# EAGLE design matrix mixer 7eurorack (EAGLE 8.2.2)
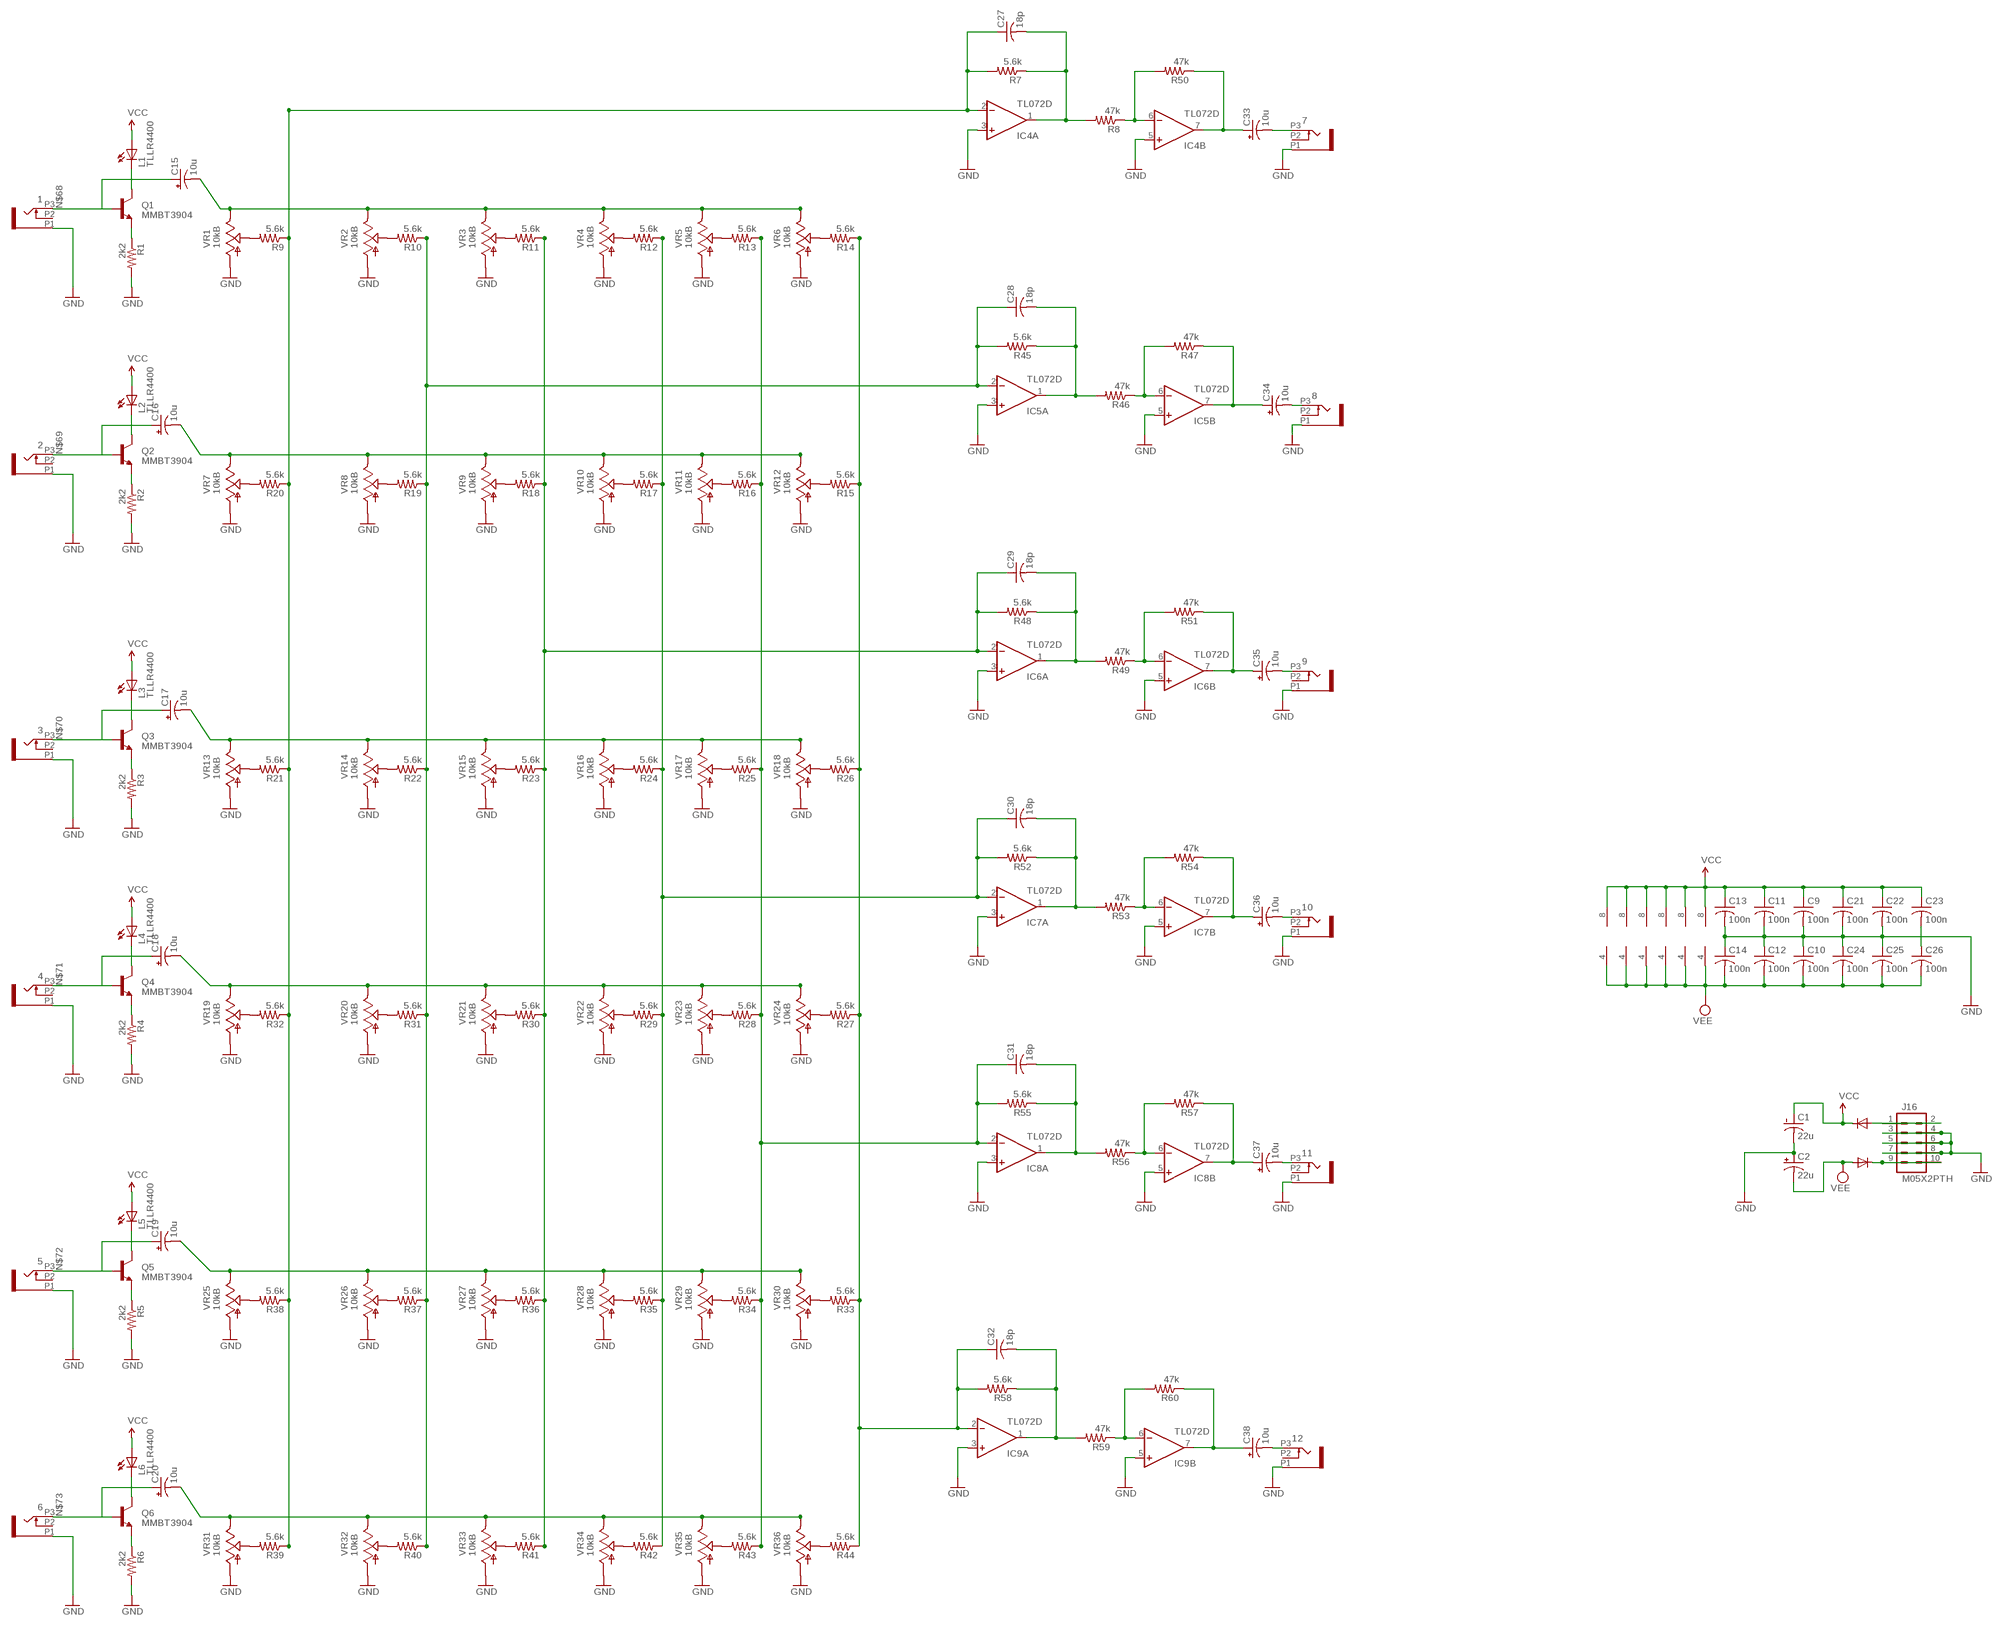
[diagram p0: schematic, sheet 1]

## Parts
1  PJ301_THONKICONN6  [WQP_PJ_301M6]
2  PJ301_THONKICONN6  [WQP_PJ_301M6]
3  PJ301_THONKICONN6  [WQP_PJ_301M6]
4  PJ301_THONKICONN6  [WQP_PJ_301M6]
5  PJ301_THONKICONN6  [WQP_PJ_301M6]
6  PJ301_THONKICONN6  [WQP_PJ_301M6]
7  PJ301_THONKICONN6  [WQP_PJ_301M6]
8  PJ301_THONKICONN6  [WQP_PJ_301M6]
9  PJ301_THONKICONN6  [WQP_PJ_301M6]
10  PJ301_THONKICONN6  [WQP_PJ_301M6]
11  PJ301_THONKICONN6  [WQP_PJ_301M6]
12  PJ301_THONKICONN6  [WQP_PJ_301M6]
C1  22u  CPOL-USB  [PANASONIC_B]
C2  22u  CPOL-USB  [PANASONIC_B]
C9  100n  C-USC0603  [C0603]
C10  100n  C-USC0603  [C0603]
C11  100n  C-USC0603  [C0603]
C12  100n  C-USC0603  [C0603]
C13  100n  C-USC0603  [C0603]
C14  100n  C-USC0603  [C0603]
C15  10u  CPOL-USB  [PANASONIC_B]
C16  10u  CPOL-USB  [PANASONIC_B]
C17  10u  CPOL-USB  [PANASONIC_B]
C18  10u  CPOL-USB  [PANASONIC_B]
C19  10u  CPOL-USB  [PANASONIC_B]
C20  10u  CPOL-USB  [PANASONIC_B]
C21  100n  C-USC0603  [C0603]
C22  100n  C-USC0603  [C0603]
C23  100n  C-USC0603  [C0603]
C24  100n  C-USC0603  [C0603]
C25  100n  C-USC0603  [C0603]
C26  100n  C-USC0603  [C0603]
C27  18p  C-USC0603  [C0603]
C28  18p  C-USC0603  [C0603]
C29  18p  C-USC0603  [C0603]
C30  18p  C-USC0603  [C0603]
C31  18p  C-USC0603  [C0603]
C32  18p  C-USC0603  [C0603]
C33  10u  CPOL-USB  [PANASONIC_B]
C34  10u  CPOL-USB  [PANASONIC_B]
C35  10u  CPOL-USB  [PANASONIC_B]
C36  10u  CPOL-USB  [PANASONIC_B]
C37  10u  CPOL-USB  [PANASONIC_B]
C38  10u  CPOL-USB  [PANASONIC_B]
D1  1N5819HW  DIODE-SOD123  [SOD123]
D2  1N5819HW  DIODE-SOD123  [SOD123]
IC4  TL072D  [SO08]
IC5  TL072D  [SO08]
IC6  TL072D  [SO08]
IC7  TL072D  [SO08]
IC8  TL072D  [SO08]
IC9  TL072D  [SO08]
J16  M05X2PTH  [AVR_ICSP]
L1  TLLR4400  [LED3MM]
L2  TLLR4400  [LED3MM]
L3  TLLR4400  [LED3MM]
L4  TLLR4400  [LED3MM]
L5  TLLR4400  [LED3MM]
L6  TLLR4400  [LED3MM]
Q1  MMBT3904  MMBT3904LT1-NPN-SOT23-BEC  [SOT23-BEC]
Q2  MMBT3904  MMBT3904LT1-NPN-SOT23-BEC  [SOT23-BEC]
Q3  MMBT3904  MMBT3904LT1-NPN-SOT23-BEC  [SOT23-BEC]
Q4  MMBT3904  MMBT3904LT1-NPN-SOT23-BEC  [SOT23-BEC]
Q5  MMBT3904  MMBT3904LT1-NPN-SOT23-BEC  [SOT23-BEC]
Q6  MMBT3904  MMBT3904LT1-NPN-SOT23-BEC  [SOT23-BEC]
R1  2k2  R-US_R0603  [R0603]
R2  2k2  R-US_R0603  [R0603]
R3  2k2  R-US_R0603  [R0603]
R4  2k2  R-US_R0603  [R0603]
R5  2k2  R-US_R0603  [R0603]
R6  2k2  R-US_R0603  [R0603]
R7  5.6k  R-US_R0603  [R0603]
R8  47k  R-US_R0603  [R0603]
R9  5.6k  R-US_R0603  [R0603]
R10  5.6k  R-US_R0603  [R0603]
R11  5.6k  R-US_R0603  [R0603]
R12  5.6k  R-US_R0603  [R0603]
R13  5.6k  R-US_R0603  [R0603]
R14  5.6k  R-US_R0603  [R0603]
R15  5.6k  R-US_R0603  [R0603]
R16  5.6k  R-US_R0603  [R0603]
R17  5.6k  R-US_R0603  [R0603]
R18  5.6k  R-US_R0603  [R0603]
R19  5.6k  R-US_R0603  [R0603]
R20  5.6k  R-US_R0603  [R0603]
R21  5.6k  R-US_R0603  [R0603]
R22  5.6k  R-US_R0603  [R0603]
R23  5.6k  R-US_R0603  [R0603]
R24  5.6k  R-US_R0603  [R0603]
R25  5.6k  R-US_R0603  [R0603]
R26  5.6k  R-US_R0603  [R0603]
R27  5.6k  R-US_R0603  [R0603]
R28  5.6k  R-US_R0603  [R0603]
R29  5.6k  R-US_R0603  [R0603]
R30  5.6k  R-US_R0603  [R0603]
R31  5.6k  R-US_R0603  [R0603]
R32  5.6k  R-US_R0603  [R0603]
R33  5.6k  R-US_R0603  [R0603]
R34  5.6k  R-US_R0603  [R0603]
R35  5.6k  R-US_R0603  [R0603]
R36  5.6k  R-US_R0603  [R0603]
R37  5.6k  R-US_R0603  [R0603]
R38  5.6k  R-US_R0603  [R0603]
R39  5.6k  R-US_R0603  [R0603]
R40  5.6k  R-US_R0603  [R0603]
R41  5.6k  R-US_R0603  [R0603]
R42  5.6k  R-US_R0603  [R0603]
R43  5.6k  R-US_R0603  [R0603]
R44  5.6k  R-US_R0603  [R0603]
R45  5.6k  R-US_R0603  [R0603]
R46  47k  R-US_R0603  [R0603]
R47  47k  R-US_R0603  [R0603]
R48  5.6k  R-US_R0603  [R0603]
R49  47k  R-US_R0603  [R0603]
R50  47k  R-US_R0603  [R0603]
R51  47k  R-US_R0603  [R0603]
R52  5.6k  R-US_R0603  [R0603]
R53  47k  R-US_R0603  [R0603]
R54  47k  R-US_R0603  [R0603]
R55  5.6k  R-US_R0603  [R0603]
R56  47k  R-US_R0603  [R0603]
R57  47k  R-US_R0603  [R0603]
R58  5.6k  R-US_R0603  [R0603]
R59  47k  R-US_R0603  [R0603]
R60  47k  R-US_R0603  [R0603]
VR1  10kB  POT_USVERTICAL_PS  [ALPS_POT_VERTICAL_PS]
VR2  10kB  POT_USVERTICAL_PS  [ALPS_POT_VERTICAL_PS]
VR3  10kB  POT_USVERTICAL_PS  [ALPS_POT_VERTICAL_PS]
VR4  10kB  POT_USVERTICAL_PS  [ALPS_POT_VERTICAL_PS]
VR5  10kB  POT_USVERTICAL_PS  [ALPS_POT_VERTICAL_PS]
VR6  10kB  POT_USVERTICAL_PS  [ALPS_POT_VERTICAL_PS]
VR7  10kB  POT_USVERTICAL_PS  [ALPS_POT_VERTICAL_PS]
VR8  10kB  POT_USVERTICAL_PS  [ALPS_POT_VERTICAL_PS]
VR9  10kB  POT_USVERTICAL_PS  [ALPS_POT_VERTICAL_PS]
VR10  10kB  POT_USVERTICAL_PS  [ALPS_POT_VERTICAL_PS]
VR11  10kB  POT_USVERTICAL_PS  [ALPS_POT_VERTICAL_PS]
VR12  10kB  POT_USVERTICAL_PS  [ALPS_POT_VERTICAL_PS]
VR13  10kB  POT_USVERTICAL_PS  [ALPS_POT_VERTICAL_PS]
VR14  10kB  POT_USVERTICAL_PS  [ALPS_POT_VERTICAL_PS]
VR15  10kB  POT_USVERTICAL_PS  [ALPS_POT_VERTICAL_PS]
VR16  10kB  POT_USVERTICAL_PS  [ALPS_POT_VERTICAL_PS]
VR17  10kB  POT_USVERTICAL_PS  [ALPS_POT_VERTICAL_PS]
VR18  10kB  POT_USVERTICAL_PS  [ALPS_POT_VERTICAL_PS]
VR19  10kB  POT_USVERTICAL_PS  [ALPS_POT_VERTICAL_PS]
VR20  10kB  POT_USVERTICAL_PS  [ALPS_POT_VERTICAL_PS]
VR21  10kB  POT_USVERTICAL_PS  [ALPS_POT_VERTICAL_PS]
VR22  10kB  POT_USVERTICAL_PS  [ALPS_POT_VERTICAL_PS]
VR23  10kB  POT_USVERTICAL_PS  [ALPS_POT_VERTICAL_PS]
VR24  10kB  POT_USVERTICAL_PS  [ALPS_POT_VERTICAL_PS]
VR25  10kB  POT_USVERTICAL_PS  [ALPS_POT_VERTICAL_PS]
VR26  10kB  POT_USVERTICAL_PS  [ALPS_POT_VERTICAL_PS]
VR27  10kB  POT_USVERTICAL_PS  [ALPS_POT_VERTICAL_PS]
VR28  10kB  POT_USVERTICAL_PS  [ALPS_POT_VERTICAL_PS]
VR29  10kB  POT_USVERTICAL_PS  [ALPS_POT_VERTICAL_PS]
VR30  10kB  POT_USVERTICAL_PS  [ALPS_POT_VERTICAL_PS]
VR31  10kB  POT_USVERTICAL_PS  [ALPS_POT_VERTICAL_PS]
VR32  10kB  POT_USVERTICAL_PS  [ALPS_POT_VERTICAL_PS]
VR33  10kB  POT_USVERTICAL_PS  [ALPS_POT_VERTICAL_PS]
VR34  10kB  POT_USVERTICAL_PS  [ALPS_POT_VERTICAL_PS]
VR35  10kB  POT_USVERTICAL_PS  [ALPS_POT_VERTICAL_PS]
VR36  10kB  POT_USVERTICAL_PS  [ALPS_POT_VERTICAL_PS]

## Nets
GND: 1.P1 2.P1 3.P1 4.P1 5.P1 6.P1 7.P1 8.P1 9.P1 10.P1 11.P1 12.P1 C1.- C2.+ C9.2 C10.1 C11.2 C12.1 C13.2 C14.1 C21.2 C22.2 C23.2 C24.1 C25.1 C26.1 IC4.3(A:+IN) IC4.5(B:+IN) IC5.3(A:+IN) IC5.5(B:+IN) IC6.3(A:+IN) IC6.5(B:+IN) IC7.3(A:+IN) IC7.5(B:+IN) IC8.3(A:+IN) IC8.5(B:+IN) IC9.3(A:+IN) IC9.5(B:+IN) J16.3 J16.4 J16.5 J16.6 J16.7 J16.8 R1.2 R2.2 R3.2 R4.2 R5.2 R6.2 VR1.P$3(A) VR2.P$3(A) VR3.P$3(A) VR4.P$3(A) VR5.P$3(A) VR6.P$3(A) VR7.P$3(A) VR8.P$3(A) VR9.P$3(A) VR10.P$3(A) VR11.P$3(A) VR12.P$3(A) VR13.P$3(A) VR14.P$3(A) VR15.P$3(A) VR16.P$3(A) VR17.P$3(A) VR18.P$3(A) VR19.P$3(A) VR20.P$3(A) VR21.P$3(A) VR22.P$3(A) VR23.P$3(A) VR24.P$3(A) VR25.P$3(A) VR26.P$3(A) VR27.P$3(A) VR28.P$3(A) VR29.P$3(A) VR30.P$3(A) VR31.P$3(A) VR32.P$3(A) VR33.P$3(A) VR34.P$3(A) VR35.P$3(A) VR36.P$3(A)
INPUT_1: C15.- VR1.P$1(E) VR2.P$1(E) VR3.P$1(E) VR4.P$1(E) VR5.P$1(E) VR6.P$1(E)
INPUT_2: C16.- VR7.P$1(E) VR8.P$1(E) VR9.P$1(E) VR10.P$1(E) VR11.P$1(E) VR12.P$1(E)
INPUT_3: C17.- VR13.P$1(E) VR14.P$1(E) VR15.P$1(E) VR16.P$1(E) VR17.P$1(E) VR18.P$1(E)
INPUT_4: C18.- VR19.P$1(E) VR20.P$1(E) VR21.P$1(E) VR22.P$1(E) VR23.P$1(E) VR24.P$1(E)
INPUT_5: C19.- VR25.P$1(E) VR26.P$1(E) VR27.P$1(E) VR28.P$1(E) VR29.P$1(E) VR30.P$1(E)
INPUT_6: C20.- VR31.P$1(E) VR32.P$1(E) VR33.P$1(E) VR34.P$1(E) VR35.P$1(E) VR36.P$1(E)
N$1: R9.2 VR1.P$2(S)
N$2: Q2.E R2.1
N$3: Q1.E R1.1
N$4: R10.2 VR2.P$2(S)
N$5: R11.2 VR3.P$2(S)
N$6: 12.P3 C38.-
N$7: L2.K(C) Q2.C
N$8: L1.K(C) Q1.C
N$9: R12.2 VR4.P$2(S)
N$10: R13.2 VR5.P$2(S)
N$11: R14.2 VR6.P$2(S)
N$12: L4.K(C) Q4.C
N$13: R15.2 VR12.P$2(S)
N$14: R16.2 VR11.P$2(S)
N$15: L3.K(C) Q3.C
N$16: R17.2 VR10.P$2(S)
N$17: R18.2 VR9.P$2(S)
N$18: R19.2 VR8.P$2(S)
N$19: R20.2 VR7.P$2(S)
N$20: Q4.E R4.1
N$21: R21.2 VR13.P$2(S)
N$22: R22.2 VR14.P$2(S)
N$23: R23.2 VR15.P$2(S)
N$24: R24.2 VR16.P$2(S)
N$25: R25.2 VR17.P$2(S)
N$26: R26.2 VR18.P$2(S)
N$27: Q3.E R3.1
N$28: R27.2 VR24.P$2(S)
N$29: L6.K(C) Q6.C
N$30: L5.K(C) Q5.C
N$31: Q6.E R6.1
N$32: Q5.E R5.1
N$33: 11.P3 C37.-
N$34: 10.P3 C36.-
N$35: 9.P3 C35.-
N$36: 8.P3 C34.-
N$37: 7.P3 C33.-
N$38: R28.2 VR23.P$2(S)
N$39: R29.2 VR22.P$2(S)
N$40: R30.2 VR21.P$2(S)
N$41: R31.2 VR20.P$2(S)
N$42: R32.2 VR19.P$2(S)
N$43: R33.2 VR30.P$2(S)
N$44: D1.A J16.1 J16.2
N$45: R34.2 VR29.P$2(S)
N$46: D2.C J16.9 J16.10
N$50: R35.2 VR28.P$2(S)
N$51: R36.2 VR27.P$2(S)
N$52: R37.2 VR26.P$2(S)
N$53: R38.2 VR25.P$2(S)
N$54: R39.2 VR31.P$2(S)
N$55: R40.2 VR32.P$2(S)
N$56: R41.2 VR33.P$2(S)
N$57: R42.2 VR34.P$2(S)
N$60: R43.2 VR35.P$2(S)
N$61: R44.2 VR36.P$2(S)
N$62: C27.1 IC4.2(A:-IN) R7.2 R9.1 R20.1 R21.1 R32.1 R38.1 R39.1
N$63: C28.1 IC5.2(A:-IN) R10.1 R19.1 R22.1 R31.1 R37.1 R40.1 R45.2
N$64: C29.1 IC6.2(A:-IN) R11.1 R18.1 R23.1 R30.1 R36.1 R41.1 R48.2
N$65: C30.1 IC7.2(A:-IN) R12.1 R17.1 R24.1 R29.1 R35.1 R42.1 R52.2
N$66: C31.1 IC8.2(A:-IN) R13.1 R16.1 R25.1 R28.1 R34.1 R43.1 R55.2
N$67: C32.1 IC9.2(A:-IN) R14.1 R15.1 R26.1 R27.1 R33.1 R44.1 R58.2
N$68: 1.P3 C15.+ Q1.B
N$69: 2.P3 C16.+ Q2.B
N$70: 3.P3 C17.+ Q3.B
N$71: 4.P3 C18.+ Q4.B
N$72: 5.P3 C19.+ Q5.B
N$73: 6.P3 C20.+ Q6.B
N$74: C27.2 IC4.1(A:OUT) R7.1 R8.2
N$75: IC4.6(B:-IN) R8.1 R50.2
N$76: C33.+ IC4.7(B:OUT) R50.1
N$78: C28.2 IC5.1(A:OUT) R45.1 R46.2
N$79: IC5.6(B:-IN) R46.1 R47.2
N$80: C34.+ IC5.7(B:OUT) R47.1
N$83: C29.2 IC6.1(A:OUT) R48.1 R49.2
N$84: IC6.6(B:-IN) R49.1 R51.2
N$85: C35.+ IC6.7(B:OUT) R51.1
N$86: C30.2 IC7.1(A:OUT) R52.1 R53.2
N$87: IC7.6(B:-IN) R53.1 R54.2
N$88: C36.+ IC7.7(B:OUT) R54.1
N$90: C31.2 IC8.1(A:OUT) R55.1 R56.2
N$91: IC8.6(B:-IN) R56.1 R57.2
N$92: C37.+ IC8.7(B:OUT) R57.1
N$94: C32.2 IC9.1(A:OUT) R58.1 R59.2
N$95: IC9.6(B:-IN) R59.1 R60.2
N$96: C38.+ IC9.7(B:OUT) R60.1
VCC: C1.+ C9.1 C11.1 C13.1 C21.1 C22.1 C23.1 D1.C IC4.8(P:V+) IC5.8(P:V+) IC6.8(P:V+) IC7.8(P:V+) IC8.8(P:V+) IC9.8(P:V+) L1.A L2.A L3.A L4.A L5.A L6.A
VEE: C2.- C10.2 C12.2 C14.2 C24.2 C25.2 C26.2 D2.A IC4.4(P:V-) IC5.4(P:V-) IC6.4(P:V-) IC7.4(P:V-) IC8.4(P:V-) IC9.4(P:V-)
Unconnected: 1.P2 2.P2 3.P2 4.P2 5.P2 6.P2 7.P2 8.P2 9.P2 10.P2 11.P2 12.P2

## Library data of the parts
1-12 = og-pj301:PJ301_THONKICONN
C1 C2 C15-C20 C33-C38 = rcl:CPOL-US: POLARIZED CAPACITOR, American symbol
C9-C14 C21-C32 = rcl:C-US: CAPACITOR, American symbol
D1 D2 = diode:DIODE-: DIODE
IC4-IC9 = linear:TL072: OP AMP
J16 = og-header:M05X2: Header 5x2 Standard 10-pin dual row 0.1" header. Commonly used with AVR-ISP. Use with Spark Fun Electronics SKU: PRT-00778
L1-L6 = led:TLLR4400: Low Current (2mA) LED 3 mm Tinted Diffused Package color RED Source: Data sheet <http://www.farnell.com/datasheets/391100.pdf>; MF: VISHAY SEMICONDUCTOR; OC_FARNELL: 1612437
Q1-Q6 = transistor:*-NPN-: NPN Transistror BF959 corrected 2008.03.06
R1-R60 = rcl:R-US_: RESISTOR, American symbol
VR1-VR36 = pot-alps:POT_US

## Board
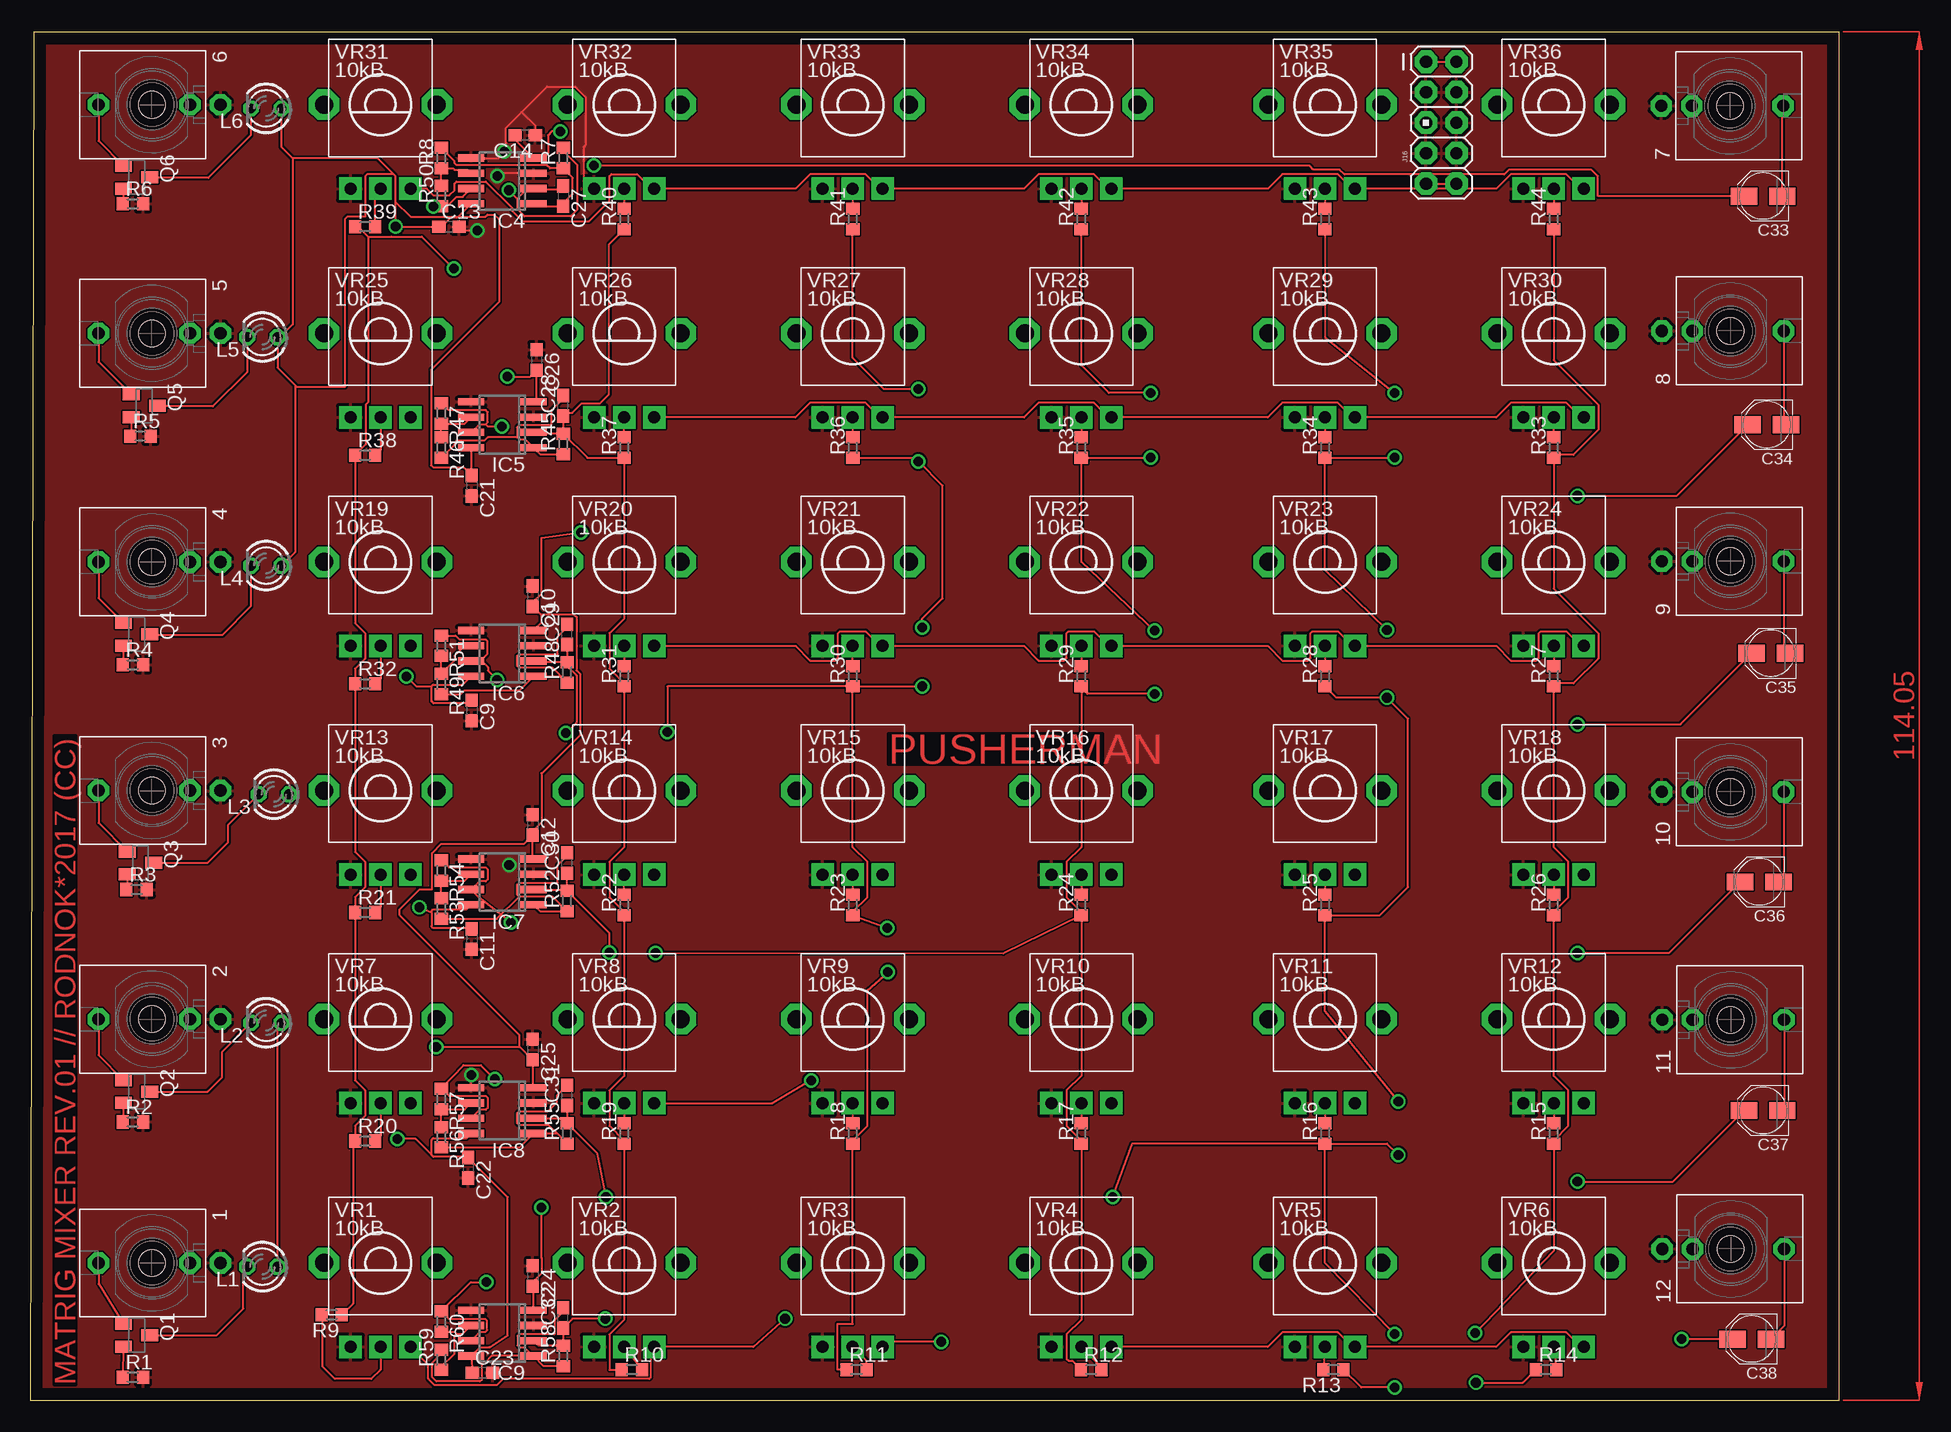
[diagram p1: board, top side]
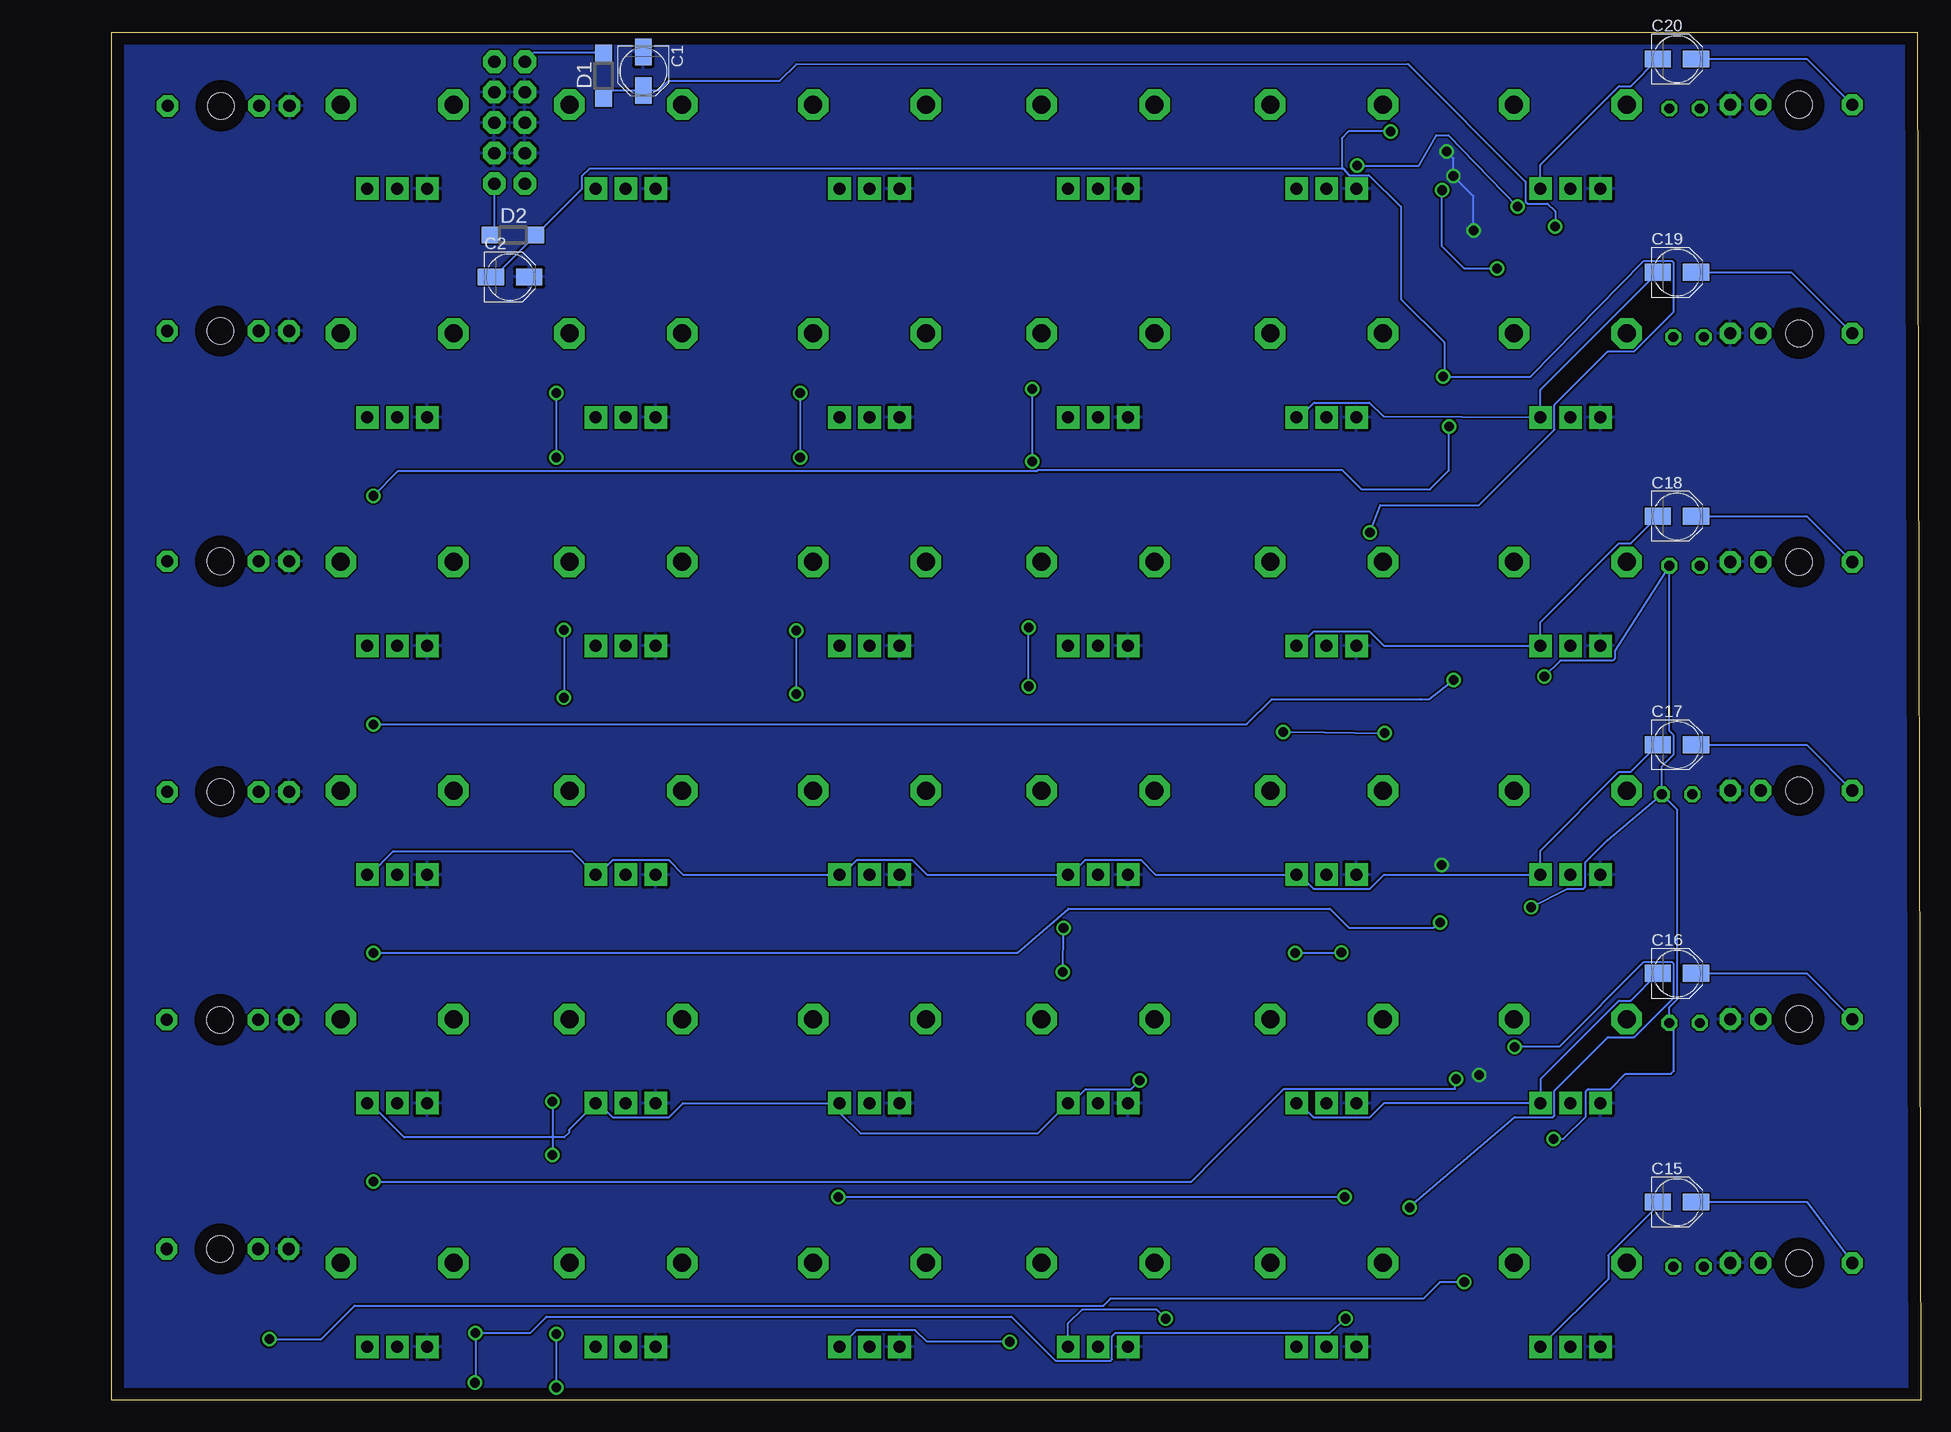
[diagram p2: board, bottom side, seen from below]

Size 150.8 x 113.97 mm. Coordinates in mm from the lower left corner, seen from the top.
Outline: 0,0 150.8,0 150.8,113.97 0.32,113.97 0,0
Copper layers (1*16): Top 0.035mm / dielectric 1.5mm / Bottom 0.035mm
Design rules "default": minimum track width 6mil, minimum drill 0.35mm, track to track 6mil, track to pad 6mil, pad to pad 6mil, via to via 6mil, smd to smd 6mil, copper to edge 40mil, drill to drill 6mil, minimum pad ring 10mil, minimum via ring 8mil, stop-mask expansion 4mil, vias tented up to drill 0mil, thermal gap 10mil

### Footprints (pad centres in the part's own frame; a part is rotated, then mirrored left to right if it is on the bottom)
WQP_PJ_301M6 = drill 1.016 pad 1.778 octagon: P1 0,-5.715; P2 0,-3.175; P3 0,4.445 | hole 2.2: 0,0
PANASONIC_B = smd 2.2 x 1.4: + 1.6,0; - -1.6,0
C0603 = smd 1.1 x 1: 1 -0.85,0; 2 0.85,0
SOD123 = smd 1.4 x 1.4: A 1.9,0; C -1.9,0
SO08 = smd 0.6 x 2.2: 1 -1.905,-2.6; 2 -0.635,-2.6; 3 0.635,-2.6; 4 1.905,-2.6; 5 1.905,2.6; 6 0.635,2.6; 7 -0.635,2.6; 8 -1.905,2.6
AVR_ICSP = drill 1.016 pad 1.88 octagon: 1 -1.27,5.08; 2 1.27,5.08; 3 -1.27,2.54; 4 1.27,2.54; 5 -1.27,0; 6 1.27,0; 7 -1.27,-2.54; 8 1.27,-2.54; 9 -1.27,-5.08; 10 1.27,-5.08
LED3MM = drill 0.813 octagon: A -1.27,0; K 1.27,0
SOT23-BEC = smd 1 x 1.4: B -0.95,-1.1; C 0,1.1; E 0.95,-1.1
R0603 = smd 1 x 1.1: 1 -0.85,0; 2 0.85,0
ALPS_POT_VERTICAL_PS = drill 1 pad 1.88 square: P$1 -2.5,7; P$2 0,7; P$3 2.5,7 | drill 1.5 pad 2.54 octagon: P$4 -4.7,0; P$5 4.7,0

### Placement (x,y rotation side)
1  10.16,11.43 90 top
2  10.16,31.75 90 top
3  10.16,50.8 90 top
4  10.16,69.85 90 top
5  10.16,88.9 90 top
6  10.16,107.95 90 top
7  141.69,107.86 270 top
8  141.73,89.1 270 top
9  141.73,69.91 270 top
10  141.73,50.69 270 top
11  141.77,31.69 270 top
12  141.77,12.6 270 top
C1  106.49,110.74 270 bottom
C2  117.6,93.6 0 bottom
C9  36.83,57.47 270 top
C10  41.91,66.99 270 top
C11  36.83,38.42 270 top
C12  41.91,47.94 270 top
C13  34.93,97.79 0 top
C14  41.27,105.41 180 top
C15  20.32,16.51 0 bottom
C16  20.32,35.56 0 bottom
C17  20.32,54.61 0 bottom
C18  20.32,73.66 0 bottom
C19  20.32,93.98 0 bottom
C20  20.32,111.76 0 bottom
C21  36.83,76.2 270 top
C22  36.51,19.37 270 top
C23  37.72,2.29 0 top
C24  41.91,10.35 270 top
C25  41.91,29.21 270 top
C26  42.23,86.68 270 top
C27  44.45,100.33 270 top
C28  44.45,82.87 90 top
C29  44.77,63.82 90 top
C30  44.77,44.77 90 top
C31  44.77,25.4 90 top
C32  44.45,6.86 90 top
C33  144.46,100.33 180 top
C34  144.78,81.28 180 top
C35  145.1,62.23 180 top
C36  144.15,43.18 180 top
C37  144.46,24.13 180 top
C38  143.51,5.08 180 top
D1  109.79,110.36 90 bottom
D2  117.35,97.09 0 bottom
IC4  39.37,101.6 90 top
IC5  39.37,81.28 90 top
IC6  39.37,62.23 90 top
IC7  39.37,43.18 90 top
IC8  39.37,24.13 90 top
IC9  39.37,5.59 90 top
J16  117.64,106.45 0 top
L1  19.37,11.11 180 top
L2  19.69,31.43 180 top
L3  20.32,50.48 180 top
L4  19.69,69.53 180 top
L5  19.37,88.58 180 top
L6  19.69,107.63 180 top
Q1  8.89,5.4 270 top
Q2  8.89,25.72 270 top
Q3  9.21,44.77 270 top
Q4  8.89,63.82 270 top
Q5  9.52,82.87 270 top
Q6  8.89,101.92 270 top
R1  8.57,1.91 0 top
R2  8.57,23.18 0 top
R3  8.89,42.55 0 top
R4  8.57,61.28 0 top
R5  9.21,80.33 0 top
R6  8.57,99.69 0 top
R7  44.45,103.5 90 top
R8  34.29,103.5 90 top
R9  25.15,7.11 180 top
R10  50.16,2.54 0 top
R11  68.9,2.54 0 top
R12  88.46,2.54 0 top
R13  108.65,2.54 180 top
R14  126.36,2.54 0 top
R15  127,22.22 90 top
R16  107.95,22.22 90 top
R17  87.63,22.22 90 top
R18  68.58,22.22 90 top
R19  49.53,22.22 90 top
R20  27.94,21.59 0 top
R21  27.94,40.64 0 top
R22  49.53,41.28 90 top
R23  68.58,41.28 90 top
R24  87.63,41.28 90 top
R25  107.95,41.28 90 top
R26  127,41.28 90 top
R27  127,60.33 90 top
R28  107.95,60.33 90 top
R29  87.63,60.33 90 top
R30  68.58,60.33 90 top
R31  49.53,60.33 90 top
R32  27.94,59.69 0 top
R33  127,79.38 90 top
R34  107.95,79.38 90 top
R35  87.63,79.38 90 top
R36  68.58,79.38 90 top
R37  49.53,79.38 90 top
R38  27.94,78.74 0 top
R39  27.94,97.79 0 top
R40  49.53,98.42 90 top
R41  68.58,98.42 90 top
R42  87.63,98.42 90 top
R43  107.95,98.42 90 top
R44  127,98.42 90 top
R45  44.45,79.69 90 top
R46  34.29,79.38 270 top
R47  34.29,82.23 270 top
R48  44.77,60.64 90 top
R49  34.29,59.69 270 top
R50  34.29,100.33 90 top
R51  34.29,62.87 270 top
R52  44.77,41.59 90 top
R53  34.29,40.96 270 top
R54  34.29,44.13 270 top
R55  44.77,22.22 90 top
R56  34.29,21.91 270 top
R57  34.29,25.08 270 top
R58  44.45,3.68 90 top
R59  34.29,3.37 90 top
R60  34.29,6.54 270 top
VR1  29.21,11.43 180 top
VR2  49.53,11.43 180 top
VR3  68.58,11.43 180 top
VR4  87.63,11.43 180 top
VR5  107.95,11.43 180 top
VR6  127,11.43 180 top
VR7  29.21,31.75 180 top
VR8  49.53,31.75 180 top
VR9  68.58,31.75 180 top
VR10  87.63,31.75 180 top
VR11  107.95,31.75 180 top
VR12  127,31.75 180 top
VR13  29.21,50.8 180 top
VR14  49.53,50.8 180 top
VR15  68.58,50.8 180 top
VR16  87.63,50.8 180 top
VR17  107.95,50.8 180 top
VR18  127,50.8 180 top
VR19  29.21,69.85 180 top
VR20  49.53,69.85 180 top
VR21  68.58,69.85 180 top
VR22  87.63,69.85 180 top
VR23  107.95,69.85 180 top
VR24  127,69.85 180 top
VR25  29.21,88.9 180 top
VR26  49.53,88.9 180 top
VR27  68.58,88.9 180 top
VR28  87.63,88.9 180 top
VR29  107.95,88.9 180 top
VR30  127,88.9 180 top
VR31  29.21,107.95 180 top
VR32  49.53,107.95 180 top
VR33  68.58,107.95 180 top
VR34  87.63,107.95 180 top
VR35  107.95,107.95 180 top
VR36  127,107.95 180 top

### Tracks (layer width: path | path; a pad name or v marks a point on that pad's centre or on a via)
GND  (via drill 0.8, 0.8 pad 0.55)
  Top 0.152: IC4.5 39.05,103.5 v39.54,104.04 39.69,104.77 39.65,104.81 39.65,106 40.98,107.33 | 40.98,107.33 43.09,109.45 45.45,109.45 46.33,108.57 46.33,104.62 46.13,104.42 46.13,101.58 46.75,100.95 VR32.P$3 | IC8.5 36.77,27.05 v36.8,27.08 | IC4.3 39.19,102.23 v38.96,102.01 | C14.1 42.12,106.19 40.98,107.33 | v37.29,97.46 36.11,97.46 C13.2
  Bottom 0.152: v36.8,27.08 36.8,27.1 36.78,27.13 | v39.54,104.04 38.96,103.47 v38.96,102.01 37.29,100.33 v37.29,97.46
  other vias: 39.94,44.58
  pour Bottom: 153.67,116.84 152.4,-3.81 -1.27,-3.81 -1.27,116.84
  pour Top: 153.67,116.84 152.4,-3.81 -1.27,-3.81 -1.27,116.84
INPUT_1  (via drill 0.8)
  Top 0.152: VR6.P$1 129.28,4.43 128.06,5.65 123.44,5.65 122.22,4.43 VR5.P$1 110.22,4.43 109.01,5.65 104.39,5.65 103.17,4.43 VR4.P$1 | v62.94,6.78 60.31,4.43 VR2.P$1 51.74,4.14 51.74,1.9 51.61,1.76 39.42,1.76 38.91,1.25 33.75,1.25 33.21,1.79 33.21,2.93 VR1.P$1 | v75.95,4.86 71.51,4.86 VR3.P$1
  Bottom 0.152: VR1.P$1 26.06,10.08 26.06,12.07 21.92,16.21 C15.- | v75.95,4.86 82.85,4.88 83.82,5.84 88.72,5.84 VR4.P$1 | VR3.P$1 71.08,6.39 69.9,7.57 63.73,7.57 v62.94,6.78
INPUT_2  (via drill 0.8 pad 0.55)
  Top 0.152: VR8.P$1 61.9,24.75 v65.11,26.64
  Bottom 0.152: C16.- 24.18,33.3 25.15,33.3 31.71,26.74 VR7.P$1 44.76,24.75 45.97,23.53 50.59,23.53 51.8,24.75 VR8.P$1 | VR12.P$1 129.28,24.75 126.41,21.88 113.07,21.88 112.69,22.27 112.69,22.51 VR11.P$1 110.22,24.75 109.01,23.53 104.39,23.53 103.17,24.75 VR10.P$1 90.13,23.96 88.39,22.22 73.6,22.22 VR9.P$1 70.78,24.75 69.61,25.92 65.84,25.92 v65.11,26.64
INPUT_3
  Bottom 0.152: C17.- 24.18,52.35 25.15,52.35 31.71,45.79 VR13.P$1 44.76,43.8 45.97,42.58 50.59,42.58 51.8,43.8 VR14.P$1 63.8,43.8 65.02,45.02 69.64,45.02 70.85,43.8 VR15.P$1 82.85,43.8 84.07,45.02 88.69,45.02 89.9,43.8 VR16.P$1 103.17,43.8 104.39,45.02 109.01,45.02 110.22,43.8 VR17.P$1 110.5,43.8 112.44,45.74 127.33,45.74 129.28,43.8 VR18.P$1
INPUT_4
  Top 0.152: VR20.P$1 63.8,62.85 65.02,61.63 67.14,61.63 67.36,61.86 67.36,63.91 67.52,64.07 69.64,64.07 70.85,62.85 VR21.P$1 82.85,62.85 84.07,61.63 86.19,61.63 86.41,61.86 86.41,63.91 86.57,64.07 88.69,64.07 89.9,62.85 VR22.P$1 103.17,62.85 104.39,61.63 106.51,61.63 106.73,61.86 106.73,63.91 106.89,64.07 109.01,64.07 110.22,62.85 VR23.P$1 122.22,62.85 123.44,61.63 125.56,61.63 125.78,61.86 125.78,63.91 125.94,64.07 128.06,64.07 129.28,62.85 VR24.P$1
  Bottom 0.152: VR20.P$1 51.8,62.85 50.59,64.07 45.97,64.07 44.76,62.85 VR19.P$1 31.71,64.84 25.15,71.4 24.18,71.4 C18.-
INPUT_5
  Top 0.152: VR30.P$1 129.28,81.9 128.06,83.12 123.44,83.12 122.22,81.9 VR29.P$1 110.22,81.9 109.01,83.12 104.39,83.12 103.17,81.9 VR28.P$1 89.9,81.9 88.69,83.12 84.07,83.12 82.85,81.9 VR27.P$1 70.85,81.9 69.64,83.12 65.02,83.12 63.8,81.9 VR26.P$1
  Bottom 0.152: VR26.P$1 51.8,81.9 50.59,83.12 45.97,83.12 44.78,82 VR25.P$1 31.71,84.19 C19.-
INPUT_6
  Top 0.152: VR31.P$1 33.08,100.95 33.62,100.4 34.96,100.4 35.39,100.83 35.39,101.38 35.55,101.54 37.99,101.54 40.18,99.35 40.18,99.11 41.05,98.24 46.6,98.24 48.31,99.96 48.31,102.01 48.47,102.17 50.59,102.17 51.8,100.95 VR32.P$1 63.8,100.95 65.02,102.17 69.64,102.17 70.85,100.95 VR33.P$1 82.85,100.95 84.07,102.17 88.69,102.17 89.9,100.95 VR34.P$1 103.17,100.95 104.39,102.17 109.01,102.17 110.22,100.95 VR35.P$1 122.22,100.95 123.44,102.17 128.06,102.17 129.28,100.95 VR36.P$1
  Bottom 0.152: C20.- 24.18,109.5 25.15,109.5 31.71,102.94 VR31.P$1
N$1
  Top 0.152: VR1.P$2 29.21,2.54 28.45,1.78 25.4,1.78 24.38,2.79 24.38,7.02 R9.2
N$2
  Top 0.152: Q2.E 7.79,23.25 R2.1
N$3
  Top 0.152: Q1.E 7.79,4.51 R1.1
N$4
  Top 0.152: VR2.P$2 R10.2
N$5
  Top 0.152: R11.2 69.75,3.26 VR3.P$2
N$6
  Top 0.152: 12.P3 146.21,6.18 C38.-
N$7
  Top 0.152: Q2.C 14.8,25.72 16,26.92 16,29.02 L2.K
N$8
  Top 0.152: Q1.C 15.56,5.4 17.78,7.62 17.78,10.79 L1.K
N$9
  Top 0.152: R12.2 89.31,2.75 VR4.P$2
N$10
  Top 0.152: VR5.P$2 R13.2
N$11
  Top 0.152: VR6.P$2 R14.2
N$12
  Top 0.152: L4.K 18.41,66.17 16,63.75 10.05,63.75 Q4.C
N$13
  Top 0.152: VR12.P$2 R15.2
N$14
  Top 0.152: VR11.P$2 R16.2
N$15
  Top 0.152: Q3.C 14.8,44.77 16.51,46.48 16.51,47.94 L3.K
N$16
  Top 0.152: VR10.P$2 R17.2
N$17
  Top 0.152: VR9.P$2 R18.2
N$18
  Top 0.152: VR8.P$2 R19.2
N$19
  Top 0.152: VR7.P$2 29.21,22.01 R20.2
N$20
  Top 0.152: Q4.E 7.79,61.35 R4.1
N$21
  Top 0.152: VR13.P$2 29.21,41.06 R21.2
N$22
  Top 0.152: R22.2 VR14.P$2
N$23
  Top 0.152: VR15.P$2 R23.2
N$24
  Top 0.152: VR16.P$2 R24.2
N$25
  Top 0.152: VR17.P$2 R25.2
N$26
  Top 0.152: VR18.P$2 R26.2
N$27
  Top 0.152: Q3.E 8.11,42.61 R3.1
N$28
  Top 0.152: VR24.P$2 R27.2
N$29
  Top 0.152: L6.K 18.41,105.41 14.86,101.85 10.05,101.85 Q6.C
N$30
  Top 0.152: L5.K 18.1,85.66 15.24,82.8 10.69,82.8 Q5.C
N$31
  Top 0.152: Q6.E 7.79,99.76 R6.1
N$32
  Top 0.152: Q5.E 8.43,80.79 8.57,80.64 8.57,80.54 R5.1
N$33
  Top 0.152: 11.P3 146.21,24.28 C37.-
N$34
  Top 0.152: 10.P3 146.18,43.61 C36.-
N$35
  Top 0.152: 9.P3 146.18,62.75 C35.-
N$36
  Top 0.152: 8.P3 146.18,81.48 C34.-
N$37
  Top 0.152: C33.- 146.06,107.78 7.P3
N$38
  Top 0.152: VR23.P$2 R28.2
N$39
  Top 0.152: VR22.P$2 R29.2
N$40
  Top 0.152: R30.2 VR21.P$2
N$41
  Top 0.152: VR20.P$2 R31.2
N$42
  Top 0.152: VR19.P$2 29.21,60.11 R32.2
N$43
  Top 0.152: R33.2 VR30.P$2
N$44
  Top 0.152: J16.1 J16.2
  Bottom 0.152: D1.A 115.64,112.26 J16.1
N$45
  Top 0.152: VR29.P$2 R34.2
N$46
  Top 0.152: J16.9 J16.10
  Bottom 0.152: J16.10 118.91,97.43 D2.C
N$50
  Top 0.152: VR28.P$2 R35.2
N$51
  Top 0.152: VR27.P$2 R36.2
N$52
  Top 0.152: R37.2 VR26.P$2
N$53
  Top 0.152: VR25.P$2 29.21,79.16 R38.2
N$54
  Top 0.152: R39.2 28.79,100.53 VR31.P$2
N$55
  Top 0.152: VR32.P$2 R40.2
N$56
  Top 0.152: VR33.P$2 R41.2
N$57
  Top 0.152: VR34.P$2 R42.2
N$60
  Top 0.152: VR35.P$2 R43.2
N$61
  Top 0.152: VR36.P$2 R44.2
N$62  (via drill 0.8 pad 0.55)
  Top 0.152: 40.59,100.11 40.59,99.28 41.22,98.65 45.07,98.65 45.64,99.22 45.64,102.91 44.45,104.1 R7.2 | 41.41,100.92 40.59,100.11 | 41.41,100.92 44.2,100.92 C27.1 | R39.1 27.35,97.79 28.17,96.96 | v39.9,100.83 39.9,100.85 40.59,100.11 | 28.17,96.96 28.17,83.14 27.99,82.96 27.99,79.64 R38.1 27.09,64.75 27.93,63.91 27.93,61.79 27.09,60.96 R32.1 27.09,45.7 27.93,44.86 27.93,42.74 27.09,41.91 R21.1 27.09,26.64 27.93,25.81 27.93,23.69 27.09,22.86 R20.1 26.92,21.59 26.92,8.04 R9.1 | IC4.2 41.45,100.96 41.41,100.92 | 28.17,96.96 30.13,96.96 32.66,96.96 v35.32,94.3
  Bottom 0.152: v35.32,94.3 38.06,94.3 39.9,96.14 v39.9,100.83
N$63
  Top 0.152: R45.2 42.07,80.54 IC5.2 | R45.2 46.47,78.52 R37.1 49.53,65.12 48.31,63.91 48.31,60.95 49.53,59.73 R31.1 49.53,46.08 48.31,44.86 48.31,41.9 49.53,40.68 R22.1 49.53,27.02 48.31,25.81 48.31,22.85 49.53,21.63 R19.1 49.53,6.71 48.31,5.49 48.31,2.53 49.3,2.53 R10.1 | R45.2 C28.1 44.45,82.27 45.2,82.27 46,83.07 47.51,83.07 48.26,83.82 48.26,96.3 R40.1
N$64  (via drill 0.8 pad 0.55)
  Top 0.152: C29.1 R48.2 | R48.2 42.07,61.49 IC6.2 | v71.51,35.67 69.8,34.16 69.8,22.85 68.58,21.63 R18.1 68.58,6.35 67.31,6.35 67.31,2.54 R11.1 | v71.46,39.33 68.68,40.32 R23.1 68.58,40.68 69.8,41.9 69.8,44.86 68.58,46.08 R30.1 | R30.1 71.54,59.48 v74.37,59.49 | R30.1 53.12,59.48 v53.14,55.68 | R48.2 44.77,61.17 45.55,60.39 45.55,56.46 v44.68,55.59 | R36.1 73.75,78.52 v74.05,78.22 76.07,76.2 76.07,66.8 74.37,65.1 v74.37,64.38 | v74.05,84.25 71.2,84.25 68.58,86.87 R41.1
  Bottom 0.152: v71.51,35.67 v71.46,39.33 | v74.37,59.49 v74.37,64.38 | v74.05,78.22 v74.05,84.25 | v53.14,55.68 49.7,55.65 v44.68,55.59
N$65  (via drill 0.8 pad 0.55, 0.8 pad 0.81)
  Top 0.152: IC7.2 44.66,42.55 R52.2 | R52.2 C30.1 | v52.15,37.26 81.14,37.24 87.58,40.38 | 87.58,40.38 R24.1 87.63,27.02 86.41,25.81 86.41,22.85 87.63,21.63 R17.1 87.63,6.71 86.41,5.49 86.41,3.45 86.6,3.26 86.88,3.26 R12.1 | 87.63,59.36 R29.1 | 87.63,59.36 87.63,46.08 86.41,44.86 86.41,41.9 87.58,40.73 87.58,40.38 | v93.74,64.12 87.63,69.85 R35.1 93.41,78.52 v93.42,78.54 | v48.3,37.29 48.3,38.91 R52.2 | v93.74,58.85 88.14,58.85 87.63,59.36 | v93.42,83.93 89.93,83.93 87.63,86.23 R42.1
  Bottom 0.152: v52.15,37.26 v48.3,37.29 | v93.42,83.93 v93.42,78.54 | v93.74,64.12 v93.74,58.85
N$66  (via drill 0.8 pad 0.55)
  Top 0.152: IC8.2 44.35,23.5 R55.2 | C31.1 R55.2 | R43.1 107.95,88.58 v113.74,83.93 | v113.11,64.19 107.95,69.21 R34.1 113.73,78.52 v113.74,78.54 | v114.06,24.88 107.95,32.38 R25.1 112.54,40.43 114.86,42.75 114.86,56.78 v113.11,58.53 108.89,58.53 R28.1 | R16.1 107.95,11.43 v113.74,5.51 | R16.1 91.86,21.38 v90.25,16.94 | v48.02,16.94 47.31,20.54 R55.2 | v113.74,1.07 110.97,1.07 R13.1 | R16.1 113.12,21.38 v114.06,20.43
  Bottom 0.152: v113.74,83.93 v113.74,78.54 | v113.11,64.19 v113.11,58.53 | v114.06,24.88 v114.06,20.43 | v113.74,5.51 v113.74,1.07 | v90.25,16.94 v48.02,16.94
N$67  (via drill 0.8)
  Top 0.152: C32.1 44.45,6.26 | R44.1 127,86.67 130.72,82.96 130.72,80.84 128.66,78.78 127.25,78.78 R33.1 127,67.62 130.72,63.91 130.72,61.79 128.66,59.73 127.25,59.73 R27.1 127,46.08 128.22,44.86 128.22,41.9 127,40.68 R26.1 127,27.02 128.22,25.81 128.22,22.85 127,21.63 R15.1 127,12.45 v120.47,5.59 | C32.1 R58.2 42.39,4.53 IC9.2 | v120.52,1.45 124.42,1.45 R14.1 | v47.95,6.78 45.22,6.78 C32.1
  Bottom 0.152: v47.95,6.78 49.27,5.6 67.11,5.6 67.41,5.3 67.41,3.4 67.55,3.26 72.11,3.26 75.81,6.96 114.55,6.96 115.92,5.59 v120.47,5.59 120.47,1.5 v120.52,1.45
N$68
  Top 0.152: 1.P3 5.72,9.69 Q1.B
  Bottom 0.152: C15.+ 9.52,16.51 1.P3
N$69
  Top 0.152: 2.P3 5.72,28.74 Q2.B
  Bottom 0.152: C16.+ 9.52,35.56 2.P3
N$70
  Top 0.152: 3.P3 5.72,48.11 Q3.B
  Bottom 0.152: C17.+ 9.52,54.61 3.P3
N$71
  Top 0.152: 4.P3 5.72,66.84 Q4.B
  Bottom 0.152: C18.+ 9.52,73.66 4.P3
N$72
  Top 0.152: 5.P3 5.72,86.53 Q5.B
  Bottom 0.152: C19.+ 10.8,93.98 5.P3
N$73
  Top 0.152: 6.P3 5.72,104.94 Q6.B
  Bottom 0.152: C20.+ 9.52,111.76 6.P3
N$74
  Top 0.152: IC4.1 42.19,99.48 C27.2 44.45,99.73 45.23,100.51 45.23,101.85 44.45,102.62 R7.1 43.34,102.66 43.08,102.93 35.55,102.93 35.39,103.09 35.39,103.25 R8.2
N$75
  Top 0.152: IC4.6 36.49,102.52 35.39,102.52 35.25,102.66 R8.1 R50.2
N$76  (via drill 0.8)
  Top 0.152: IC4.7 36.08,100.27 35.55,100.27 34.76,99.48 R50.1 34.09,99.28 v33.62,99.46 | C33.+ 130.69,100.33 130.69,101.99 130.14,102.55 123.29,102.55 122.88,102.14 109.57,102.14 109.16,102.55 107,102.55 106.68,102.87 v46.99,102.87
  Bottom 0.152: v46.99,102.87 41.85,102.87 40.38,105.41 39.37,105.41 v33.62,99.46
N$78
  Top 0.152: R45.1 42.5,78.84 IC5.1 41.28,80.07 40.75,80.07 40.59,80.23 | 40.59,80.23 40.59,81.06 40.75,81.22 43.44,81.22 43.44,82.45 44.45,83.46 C28.2 | 40.59,80.23 38.15,80.23 37.88,79.95 35.55,79.95 35.39,79.79 35.39,79.63 R46.2
N$79
  Top 0.152: IC5.6 36.24,81.38 R47.2 R46.1
N$80  (via drill 0.8)
  Top 0.152: 37.99,81.34 38.15,81.5 38.15,82.33 37.99,82.49 34.88,82.49 R47.1 | IC5.7 37.46,81.34 37.99,81.34 | v39.32,81.13 38.19,81.13 37.99,81.34 | v128.98,75.36 137.26,75.36 C34.+
  Bottom 0.152: v39.32,81.13 39.32,77.47 40.9,75.88 44.77,75.88 46.62,75.88 48.2,77.47 73.63,77.47 73.71,77.39 126.95,77.39 v128.98,75.36
N$83
  Top 0.152: R49.2 35.91,58.84 36.21,59.15 40.79,59.15 IC6.1 44.23,60.33 R48.1 43.54,61.02 40.75,61.02 40.59,61.18 40.59,62.01 40.75,62.17 43.99,62.17 43.99,63.63 44.77,64.41 C29.2
N$84
  Top 0.152: IC6.6 36.24,62.87 35.39,62.01 35.39,61.64 R49.1 R51.2
N$85  (via drill 0.8)
  Top 0.152: R51.1 35.47,63.72 35.79,63.39 37.97,63.39 38.1,63.26 38.1,62.14 37.56,61.6 IC6.7 37.64,61.6 38.18,61.06 38.18,60.78 v38.94,60.02 | v128.98,56.31 137.58,56.31 C35.+
  Bottom 0.152: v38.94,60.02 41.02,58.4 41.66,58.4 41.68,58.42 54.1,58.42 56.21,56.31 v128.98,56.31
N$86
  Top 0.152: IC7.1 42.5,40.74 R52.1 43.54,41.97 40.75,41.97 | 40.75,41.97 40.59,42.13 40.59,42.96 40.75,43.12 43.99,43.12 43.99,44.58 44.77,45.36 C30.2 | R53.2 38.9,40.11 40.75,41.97
N$87
  Top 0.152: 34.44,43.28 36.24,43.28 IC7.6 | 34.44,43.28 R54.2 | R53.1 34.29,43.13 34.44,43.28
N$88  (via drill 0.8)
  Top 0.152: R54.1 34.33,44.98 34.92,44.39 37.99,44.39 38.15,44.23 38.15,43.4 37.99,43.24 37.46,43.24 IC7.7 37.41,41.91 v40.08,39.8 | v128.98,37.26 136.63,37.26 C36.+
  Bottom 0.152: v128.98,37.26 75.32,37.29 71.06,40.96 49.27,40.96 47.68,39.37 40.64,39.37 40.34,39.6 v40.08,39.8
N$90
  Top 0.152: R56.2 40.8,21.06 IC8.1 43.92,22.22 | 43.92,22.22 R55.1 | C31.2 43.92,25.4 43.92,24.81 43.19,24.07 40.75,24.07 40.59,23.91 40.59,23.08 40.75,22.92 43.23,22.92 43.92,22.22
N$91
  Top 0.152: R56.1 R57.2 36.24,24.23 IC8.6
N$92  (via drill 0.8)
  Top 0.152: IC8.7 37.46,24.19 37.99,24.19 38.15,24.35 38.15,25.18 37.99,25.34 34.92,25.34 34.33,25.93 R57.1 36.15,27.91 37.57,27.91 v38.73,26.75 | v128.98,18.21 136.94,18.21 C37.+
  Bottom 0.152: v38.73,26.75 38.83,25.94 53.08,25.94 58.7,20.32 60.81,18.21 v128.98,18.21
N$94
  Top 0.152: R58.1 42.82,2.83 IC9.1 41.91,3.68 | 41.91,3.68 38.49,3.68 37.97,3.15 37.64,3.15 37.65,2.88 37.65,1.69 37.51,1.56 33.88,1.56 33.65,1.79 33.51,1.92 33.51,3.11 34.29,3.89 R59.2 | C32.2 44.45,7.38 43.71,6.64 43.71,5.48 40.77,5.48 40.64,5.35 40.64,4.56 40.77,4.42 41.17,4.42 41.91,3.68
N$95
  Top 0.152: 35.55,5.53 35.39,5.37 35.39,3.87 34.29,2.77 R59.1 | 35.55,5.53 36.08,5.53 IC9.6 | R60.2 35.4,5.69 35.55,5.53
N$96  (via drill 0.8)
  Top 0.152: C38.+ v137.67,5.08 | 38.11,5.84 38.1,5.83 | 38.1,5.83 37.97,5.69 37.51,5.69 IC9.7 | 38.1,5.83 38.1,6.62 37.97,6.75 34.93,6.75 R60.1 36.73,9.83 v38.05,9.83
  Bottom 0.152: v137.67,5.08 133.35,5.08 130.56,7.87 68.14,7.87 67.56,8.45 41.47,8.45 40.09,9.83 v38.05,9.83
VCC  (via drill 0.8, 0.8 pad 0.55)
  Top 0.152: IC4.8 35.64,98.57 35.11,98.57 34.33,97.79 C13.1 v30.48,97.79 30.45,97.81 30.45,99.88 | IC5.8 36.83,79.31 C21.1 36.16,77.72 33.61,77.72 33.44,77.9 33.44,85.84 39.1,91.51 39.1,98.39 38.7,98.79 38.13,98.79 37.94,98.59 31.74,98.59 30.45,99.88 | 33.46,59.46 33.46,58.22 33.62,58.06 36.34,58.06 36.6,58.32 C9.1 | 33.46,59.46 33.62,59.62 36.06,59.62 IC6.8 | 33.46,40.64 33.46,39.49 33.62,39.33 36.77,39.33 C11.1 | 33.46,40.64 33.46,40.72 33.62,40.89 36.38,40.89 IC7.8 | 33.55,20.35 33.46,20.44 33.46,21.67 33.62,21.84 36.38,21.84 IC8.8 | 33.55,20.35 33.62,20.28 36.45,20.28 C22.1 39.82,16.91 39.82,5.39 38.3,4.42 37.51,4.42 IC9.8 36.83,3.62 C23.1 | v32.47,41.07 33.46,40.64 | 21.91,103.5 28.97,103.5 30.28,102.19 | 30.28,102.19 28.14,102.19 27.96,102.02 27.96,98.64 26.46,98.64 26.29,98.47 26.29,84.45 22.23,84.45 22.1,84.58 | 30.28,102.19 30.45,102.02 30.45,99.88 | L6.A 20.96,104.46 21.91,103.5 | 21.91,103.5 21.91,89.65 20.69,88.44 L5.A 20.64,86.04 22.1,84.58 | L1.A 20.64,31.11 L2.A | 22.1,84.58 22.1,70.68 L4.A | 33.46,59.46 32.24,59.46 v31.38,60.31 | v30.62,21.77 32.13,21.77 33.55,20.35
  Bottom 0.152: v32.47,41.07 29.49,42.58 28.15,42.58 27.99,42.74 27.99,44.79 26.11,46.67 L3.A | v30.48,97.79 30.48,99.06 31.12,99.7 32.78,99.7 32.95,99.88 32.95,101.53 42.77,111.35 93.73,111.33 95.12,109.93 104.37,109.93 105.16,109.14 C1.+ 109.11,109.14 D1.C | L3.A 20.29,49.18 20.29,33.42 20.96,32.76 L2.A 20.57,31.05 20.57,27.43 20.83,27.18 24.64,27.18 25.9,25.92 27.74,25.92 27.94,25.72 27.94,23.62 29.79,21.77 v30.62,21.77 | L3.A 21.59,52.82 20.59,53.82 20.59,55.41 20.96,55.77 L4.A 25.49,62.46 25.49,61.79 25.65,61.63 30.06,61.63 v31.38,60.31
VEE  (via drill 0.8)
  Top 0.152: C14.2 40.43,105.05 IC4.4 | C26.2 42.23,83.44 IC5.4 | IC8.4 41.91,26.09 C25.2 40.81,29.46 | IC9.4 41.97,9.44 C24.2 41.91,9.83 42.64,10.56 42.64,11.84 42.62,11.86 v42.62,16.05 | C12.2 41.91,45.15 IC7.4 | IC4.4 41.97,103.75 | C26.2 42.51,86.11 | v33.86,29.44 40.81,29.46 | C12.2 41.17,46.35 34.29,46.35 33.51,45.58 33.51,42.55 32.49,42.55 30.83,40.89 30.83,40.39 40.81,30.41 40.81,29.46 | C12.2 41.91,47.42 42.64,48.15 42.64,52.2 | 42.64,52.2 42.64,52.26 | 42.61,65.45 C10.2 41.91,66.47 42.64,67.2 42.64,71.85 v45.92,72.31 | 42.61,65.45 45.36,65.45 45.55,65.26 45.55,60.82 45.85,60.51 45.85,55.41 42.64,52.2 | 42.61,65.45 42.61,64.77 IC6.4 | v39.8,85.29 41.69,85.29 C26.2 | v44.2,105.72 43.49,105.72 43.18,105.41 43.18,103.89 42.67,103.38 42.1,103.38 IC4.4
  Bottom 0.152: 48.26,102.62 48.13,102.62 47.67,102.08 46.01,102.08 43.33,99.46 43.33,91.74 39.73,88.14 39.73,85.37 v39.8,85.29 32.53,85.27 23.12,94.91 20.73,94.91 20.59,94.77 20.59,90.7 23.89,87.4 26.07,87.4 30.54,82.93 30.54,80.87 36.83,74.58 45.05,74.58 v45.92,72.31 | 48.26,102.62 110.98,102.62 111.62,101.98 111.62,100.92 D2.A 118.94,93.6 C2.- | v42.62,16.05 33.82,23.58 30.68,23.58 30.54,23.72 30.54,25.78 26.07,30.25 23.89,30.25 20.59,33.55 20.59,36.36 20.73,36.49 23.12,36.49 30.14,29.46 v33.86,29.44 | v44.2,105.72 47.7,105.72 48.26,105.16 48.26,102.62
(copper drawn outside any net)
  shapes: Top area x1

### Text on the board
Top: PUSHERMAN | MATRIG MIXER REV.01 // RODNOK*2017 (CC)